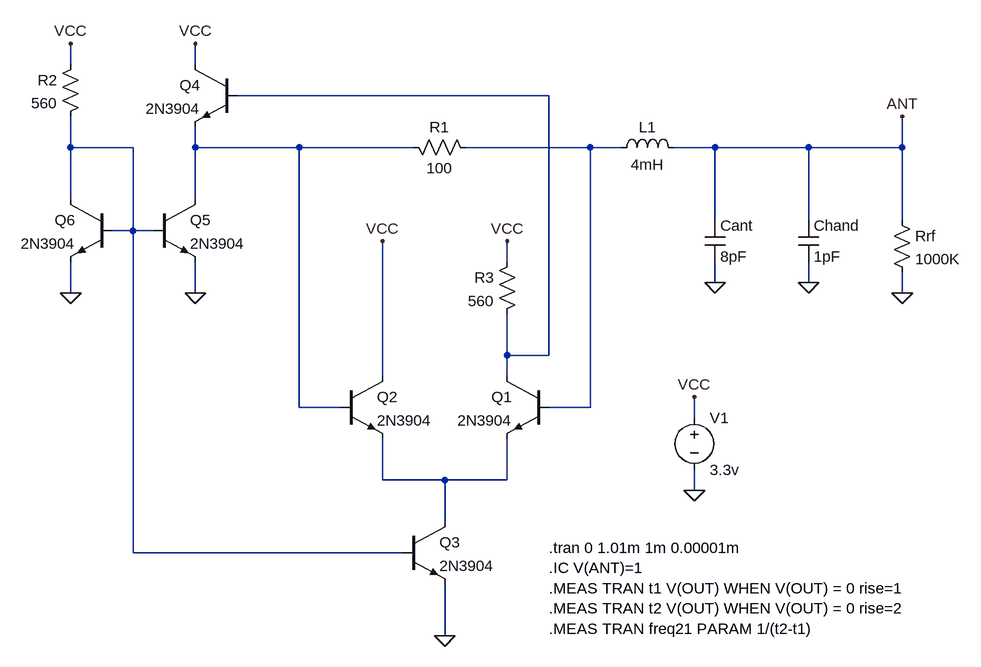
[diagram p0: schematic diff_osc_dewster_2020-11-15_experiments_v3.asc]
diff_osc_dewster_2020-11-15_experiments_v3.asc, the LTspice schematic file:
Version 4
SHEET 1 2908 996
WIRE -240 -160 -240 -192
WIRE -48 -160 -48 -192
WIRE 496 -112 16 -112
WIRE -240 -32 -240 -80
WIRE -144 -32 -240 -32
WIRE -48 -32 -48 -64
WIRE 112 -32 -48 -32
WIRE 288 -32 112 -32
WIRE 560 -32 368 -32
WIRE 608 -32 560 -32
WIRE 752 -32 688 -32
WIRE 896 -32 752 -32
WIRE 1040 -32 1040 -80
WIRE 1040 -32 896 -32
WIRE -240 48 -240 -32
WIRE -48 48 -48 -32
WIRE 752 80 752 -32
WIRE 896 80 896 -32
WIRE 1040 80 1040 -32
WIRE -144 96 -144 -32
WIRE -144 96 -176 96
WIRE -112 96 -144 96
WIRE 432 144 432 112
WIRE 752 176 752 144
WIRE 896 176 896 144
WIRE -240 192 -240 144
WIRE -48 192 -48 144
WIRE 1040 192 1040 160
WIRE 432 288 432 224
WIRE 496 288 496 -112
WIRE 496 288 432 288
WIRE 240 320 240 112
WIRE 432 320 432 288
WIRE 112 368 112 -32
WIRE 176 368 112 368
WIRE 560 368 560 -32
WIRE 560 368 496 368
WIRE 720 384 720 352
WIRE 240 480 240 416
WIRE 336 480 240 480
WIRE 432 480 432 416
WIRE 432 480 336 480
WIRE 720 496 720 464
WIRE 336 544 336 480
WIRE -144 592 -144 96
WIRE 272 592 -144 592
WIRE 336 720 336 640
FLAG 720 496 0
FLAG 720 352 VCC
FLAG 1040 -80 ANT
FLAG 752 176 0
FLAG 1040 192 0
FLAG -48 192 0
FLAG -240 -192 VCC
FLAG -240 192 0
FLAG 336 720 0
FLAG -48 -192 VCC
FLAG 240 112 VCC
FLAG 432 112 VCC
FLAG 896 176 0
SYMBOL res 384 -16 M270
WINDOW 0 32 56 VTop 2
WINDOW 3 0 56 VBottom 2
SYMATTR InstName R1
SYMATTR Value 100
SYMBOL voltage 720 368 R0
WINDOW 123 0 0 Left 2
WINDOW 39 0 0 Left 2
SYMATTR InstName V1
SYMATTR Value 3.3v
SYMBOL npn 176 320 R0
SYMATTR InstName Q2
SYMATTR Value 2N3904
SYMBOL ind 592 -16 R270
WINDOW 0 32 56 VTop 2
WINDOW 3 5 56 VBottom 2
SYMATTR InstName L1
SYMATTR Value 4mH
SYMATTR SpiceLine Rser=180 Cpar=1.2pF
SYMBOL cap 736 80 R0
SYMATTR InstName Cant
SYMATTR Value 8pF
SYMBOL npn 496 320 M0
SYMATTR InstName Q1
SYMATTR Value 2N3904
SYMBOL npn 16 -160 M0
SYMATTR InstName Q4
SYMATTR Value 2N3904
SYMBOL res 1024 64 R0
SYMATTR InstName Rrf
SYMATTR Value 1000K
SYMBOL res -224 -176 M0
SYMATTR InstName R2
SYMATTR Value 560
SYMBOL npn -112 48 R0
SYMATTR InstName Q5
SYMATTR Value 2N3904
SYMBOL npn -176 48 M0
SYMATTR InstName Q6
SYMATTR Value 2N3904
SYMBOL npn 272 544 R0
SYMATTR InstName Q3
SYMATTR Value 2N3904
SYMBOL res 448 128 M0
SYMATTR InstName R3
SYMATTR Value 560
SYMBOL cap 880 80 R0
SYMATTR InstName Chand
SYMATTR Value 1pF
TEXT 496 584 Left 2 !.tran 0 1.01m 1m 0.00001m\n.IC V(ANT)=1\n.MEAS TRAN t1 V(OUT) WHEN V(OUT) = 0 rise=1\n.MEAS TRAN t2 V(OUT) WHEN V(OUT) = 0 rise=2\n.MEAS TRAN freq21 PARAM 1/(t2-t1)

The netlist it stands for:
* diff_osc_dewster_2020-11-15_experiments_v3.asc
R1 N004 N003 100
V1 VCC 0 3.3v
Q2 VCC N003 N005 0 2N3904
L1 N004 ANT 4mH Rser=180 Cpar=1.2pF
Cant ANT 0 8pF
Q1 N001 N004 N005 0 2N3904
Q4 VCC N001 N003 0 2N3904
Rrf ANT 0 1000K
R2 VCC N002 560
Q5 N003 N002 0 0 2N3904
Q6 N002 N002 0 0 2N3904
Q3 N005 N002 0 0 2N3904
R3 VCC N001 560
Chand ANT 0 1pF
.model NPN NPN
.model PNP PNP
.lib standard.bjt
.tran 0 1.01m 1m 0.00001m
.IC V(ANT)=1
.MEAS TRAN t1 V(OUT) WHEN V(OUT) = 0 rise=1
.MEAS TRAN t2 V(OUT) WHEN V(OUT) = 0 rise=2
.MEAS TRAN freq21 PARAM 1/(t2-t1)
.backanno
.end